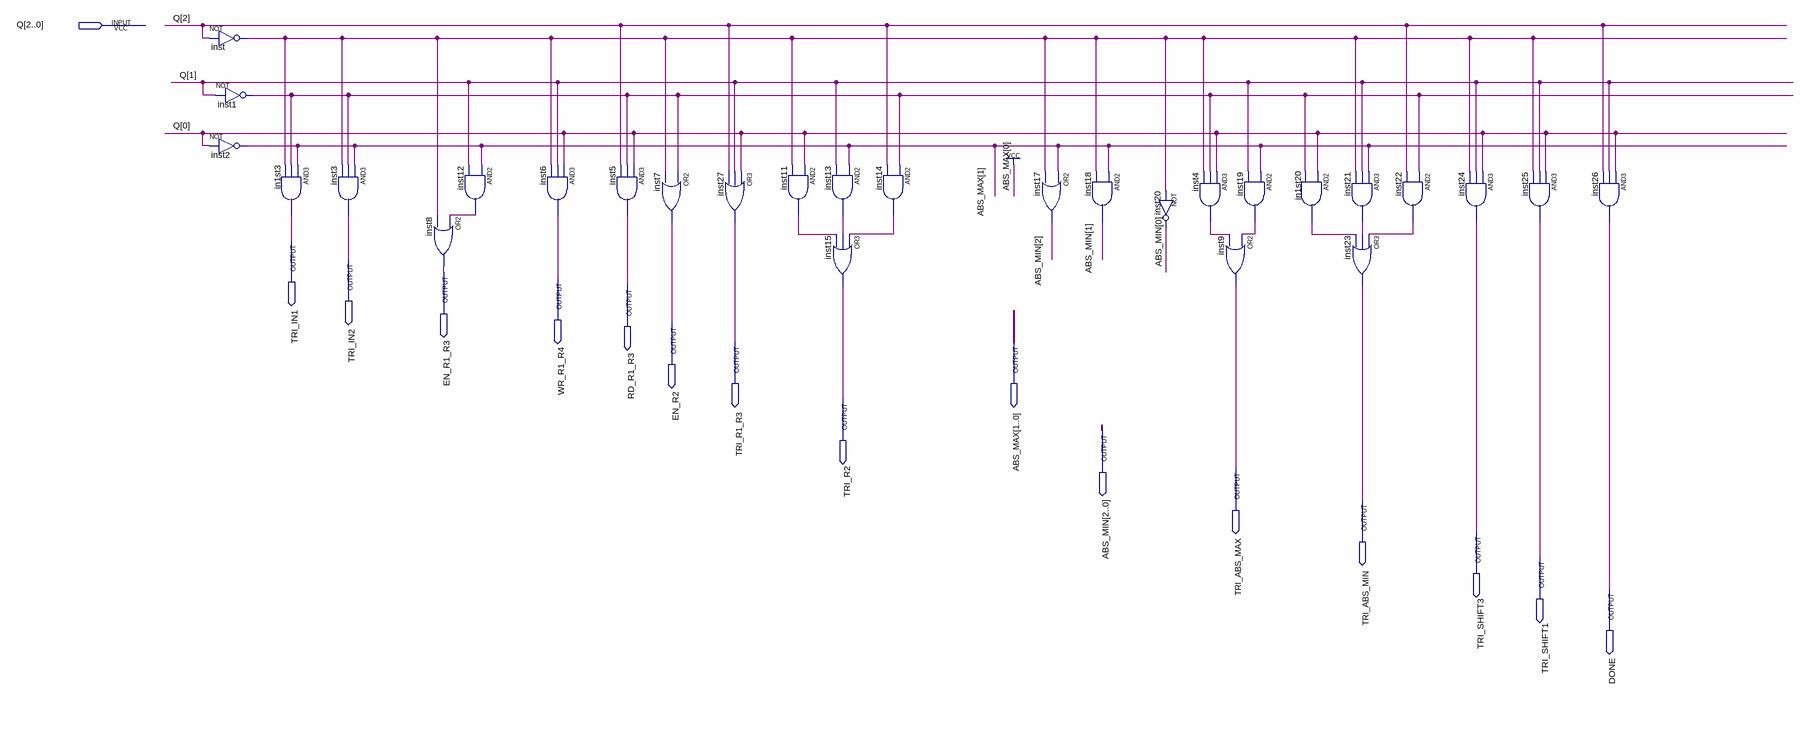
[diagram p0: schematic sheet]
// Quartus schematic CONTROLER_MR.bdf as structural Verilog: 28 symbols, 16 pins
module CONTROLER_MR (
  input  [2:0] Q,
  output TRI_IN1,
  output TRI_IN2,
  output EN_R1_R3,
  output WR_R1_R4,
  output RD_R1_R3,
  output EN_R2,
  output TRI_R1_R3,
  output [1:0] ABS_MAX,
  output TRI_R2,
  output [2:0] ABS_MIN,
  output TRI_ABS_MAX,
  output TRI_ABS_MIN,
  output TRI_SHIFT3,
  output TRI_SHIFT1,
  output DONE
);

  wire in1st20_out, inst1_out, inst4_out, inst11_out, inst12_out, inst13_out, inst14_out, inst19_out,
       inst21_out, inst22_out, inst_out;

  not inst (inst_out, Q[2]);
  not inst1 (inst1_out, Q[1]);
  not inst2 (ABS_MAX[1], Q[0]);
  and in1st3 (TRI_IN1, ABS_MAX[1], inst1_out, inst_out);
  and inst3 (TRI_IN2, ABS_MAX[1], inst1_out, inst_out);
  or inst8 (EN_R1_R3, inst12_out, inst_out);
  and inst12 (inst12_out, ABS_MAX[1], Q[1]);
  and inst6 (WR_R1_R4, Q[0], Q[1], inst_out);
  and inst5 (RD_R1_R3, Q[0], inst1_out, Q[2]);
  or inst7 (EN_R2, inst1_out, inst_out);
  or inst27 (TRI_R1_R3, Q[0], Q[1], Q[2]);
  and inst11 (inst11_out, Q[0], inst_out);
  and inst13 (inst13_out, ABS_MAX[1], Q[1]);
  or inst15 (TRI_R2, inst14_out, inst13_out, inst11_out);
  and inst14 (inst14_out, inst1_out, Q[2]);
  or inst17 (ABS_MIN[2], ABS_MAX[1], inst_out);
  and inst18 (ABS_MIN[1], ABS_MAX[1], inst_out);
  and inst4 (inst4_out, Q[0], inst1_out, inst_out);
  not inst20 (ABS_MIN[0], inst_out);
  and inst19 (inst19_out, ABS_MAX[1], Q[1]);
  or inst9 (TRI_ABS_MAX, inst19_out, inst4_out);
  and in1st20 (in1st20_out, Q[0], inst1_out);
  and inst21 (inst21_out, ABS_MAX[1], Q[1], inst_out);
  or inst23 (TRI_ABS_MIN, inst22_out, inst21_out, in1st20_out);
  and inst22 (inst22_out, inst1_out, Q[2]);
  and inst24 (TRI_SHIFT3, Q[0], Q[1], inst_out);
  and inst25 (TRI_SHIFT1, Q[0], Q[1], inst_out);
  and inst26 (DONE, Q[0], Q[1], Q[2]);

  assign ABS_MAX[0] = 1'b1;
endmodule
